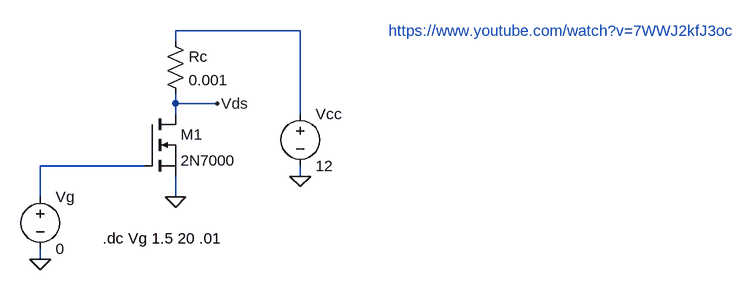
[diagram p0: schematic 2N7000 Input Characteristic Curve.asc]
2N7000 Input Characteristic Curve.asc, the LTspice schematic file:
Version 4
SHEET 1 1232 680
WIRE 448 16 256 16
WIRE 256 32 256 16
WIRE 256 128 256 112
WIRE 320 128 256 128
WIRE 256 144 256 128
WIRE 448 144 448 16
WIRE 208 224 48 224
WIRE 448 240 448 224
WIRE 48 272 48 224
WIRE 256 272 256 240
WIRE 48 368 48 352
FLAG 256 272 0
FLAG 448 240 0
FLAG 48 368 0
FLAG 320 128 Vds
SYMBOL voltage 448 128 R0
WINDOW 123 0 0 Left 2
WINDOW 39 0 0 Left 2
SYMATTR InstName Vcc
SYMATTR Value 12
SYMBOL res 240 16 R0
SYMATTR InstName Rc
SYMATTR Value 0.001
SYMBOL voltage 48 256 R0
WINDOW 123 0 0 Left 2
WINDOW 39 0 0 Left 2
SYMATTR InstName Vg
SYMATTR Value 0
SYMBOL nmos 208 144 R0
SYMATTR InstName M1
SYMATTR Value 2N7000
TEXT 144 336 Left 2 !.dc Vg 1.5 20 .01
TEXT 584 16 Left 2 ;https://www.youtube.com/watch?v=7WWJ2kfJ3oc

The netlist it stands for:
* 2N7000 Input Characteristic Curve.asc
Vcc N001 0 12
Rc N001 Vds 0.001
Vg N002 0 0
M1 Vds N002 0 0 2N7000
.model NMOS NMOS
.model PMOS PMOS
.lib standard.mos
.dc Vg 1.5 20 .01
* https://www.youtube.com/watch?v=7WWJ2kfJ3oc
.backanno
.end